# EAGLE design DAC_Test_PCB (EAGLE 9.0.0)
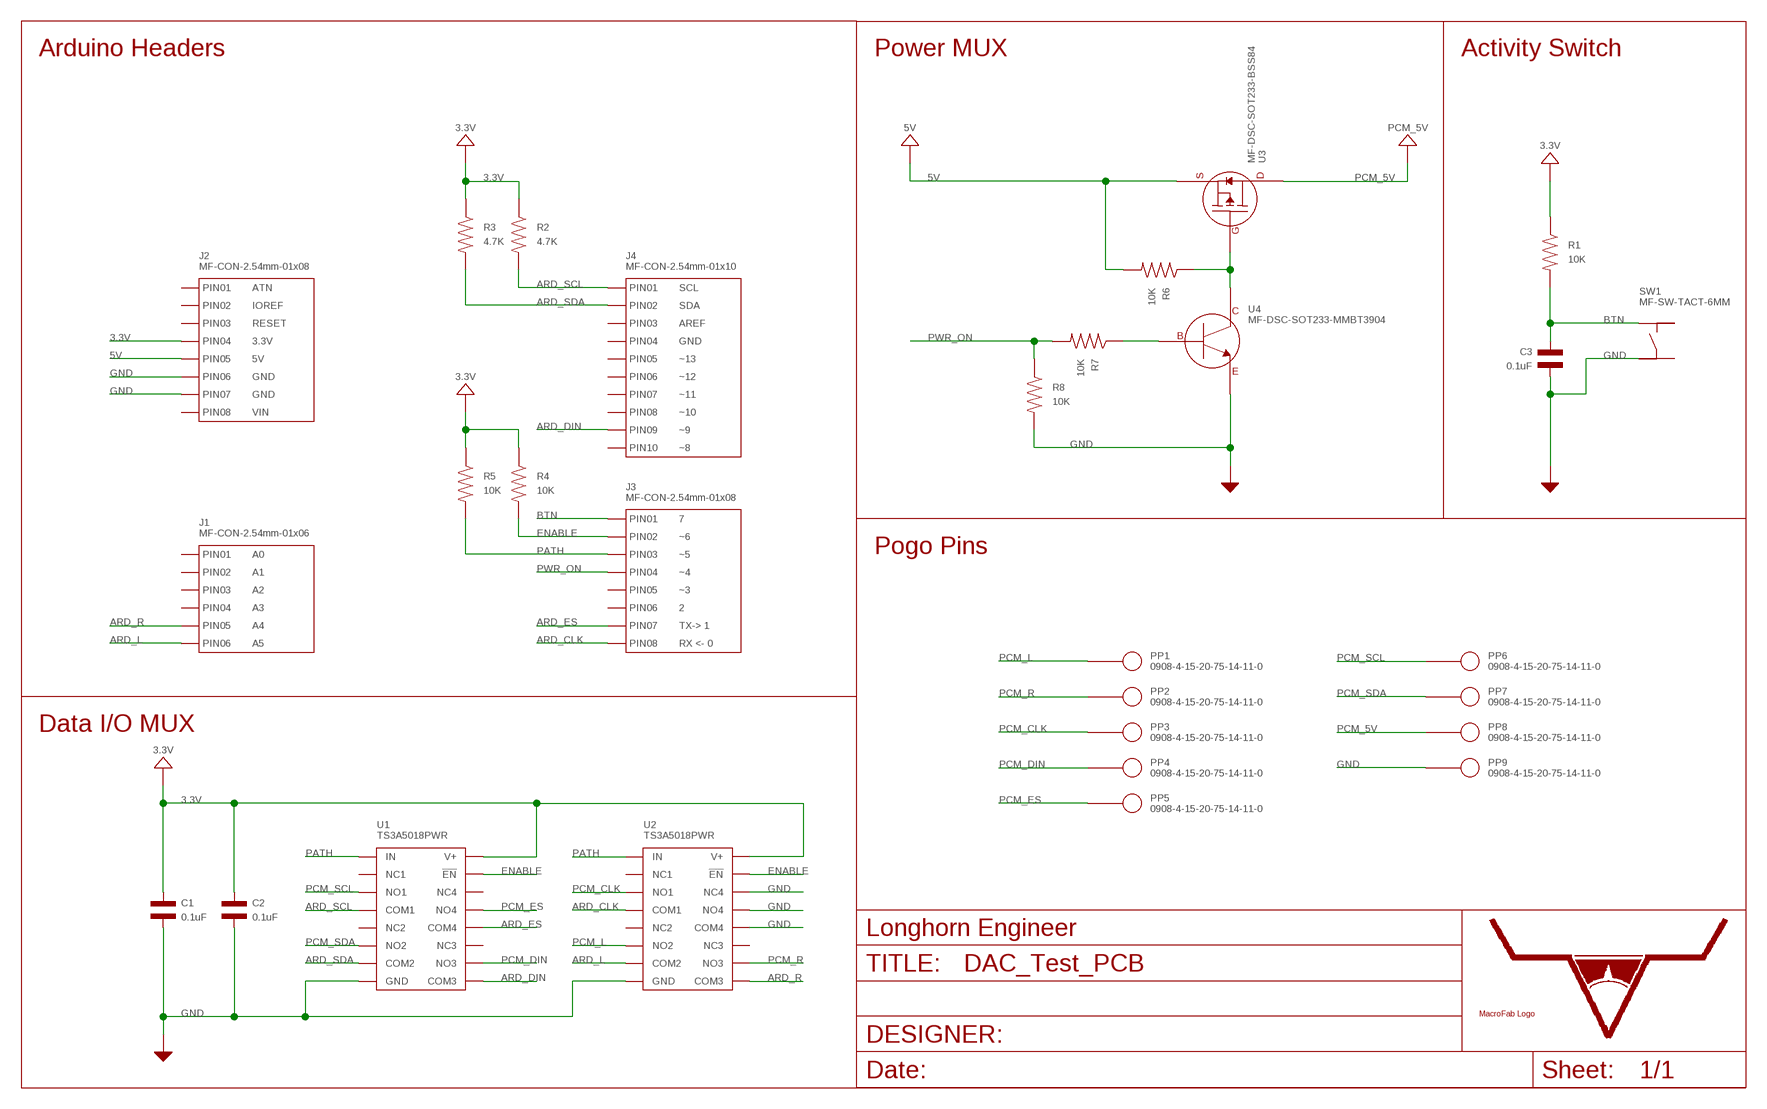
[diagram p0: schematic, sheet 1]

## Parts
C1  0.1uF  CAPACITOR_NP_0603  [C0603]
C2  0.1uF  CAPACITOR_NP_0603  [C0603]
C3  0.1uF  CAPACITOR_NP_0603  [C0603]
J1  MF-CON-2.54mm-01x06  CON_01X06_PTH_2.54MM  [PTH_2.54MM_01X06]
J2  MF-CON-2.54mm-01x08  CON_01X08_PTH_2.54MM  [PTH_2.54MM_01X08]
J3  MF-CON-2.54mm-01x08  CON_01X08_PTH_2.54MM  [PTH_2.54MM_01X08]
J4  MF-CON-2.54mm-01x10  CON_01X10_PTH_2.54MM  [PTH_2.54MM_01X10]
PP1  0908-4-15-20-75-14-11-0  POGO_PIN_0908-4-15-20-75-14-11-0  [0908-4-15-20-75-14-11-0]
PP2  0908-4-15-20-75-14-11-0  POGO_PIN_0908-4-15-20-75-14-11-0  [0908-4-15-20-75-14-11-0]
PP3  0908-4-15-20-75-14-11-0  POGO_PIN_0908-4-15-20-75-14-11-0  [0908-4-15-20-75-14-11-0]
PP4  0908-4-15-20-75-14-11-0  POGO_PIN_0908-4-15-20-75-14-11-0  [0908-4-15-20-75-14-11-0]
PP5  0908-4-15-20-75-14-11-0  POGO_PIN_0908-4-15-20-75-14-11-0  [0908-4-15-20-75-14-11-0]
PP6  0908-4-15-20-75-14-11-0  POGO_PIN_0908-4-15-20-75-14-11-0  [0908-4-15-20-75-14-11-0]
PP7  0908-4-15-20-75-14-11-0  POGO_PIN_0908-4-15-20-75-14-11-0  [0908-4-15-20-75-14-11-0]
PP8  0908-4-15-20-75-14-11-0  POGO_PIN_0908-4-15-20-75-14-11-0  [0908-4-15-20-75-14-11-0]
PP9  0908-4-15-20-75-14-11-0  POGO_PIN_0908-4-15-20-75-14-11-0  [0908-4-15-20-75-14-11-0]
R1  10K  RESISTOR_0603  [R0603]
R2  4.7K  RESISTOR_0603  [R0603]
R3  4.7K  RESISTOR_0603  [R0603]
R4  10K  RESISTOR_0603  [R0603]
R5  10K  RESISTOR_0603  [R0603]
R6  10K  RESISTOR_0603  [R0603]
R7  10K  RESISTOR_0603  [R0603]
R8  10K  RESISTOR_0603  [R0603]
SW1  MF-SW-TACT-6MM  TACT_6MM  [TACT6MM]
U1  TS3A5018PWR  [TS3A5018_TTSOP-16]
U2  TS3A5018PWR  [TS3A5018_TTSOP-16]
U3  MF-DSC-SOT233-BSS84  P-CHANNEL_FET_BSS84_SOT-23-3  [SOT-23-3]
U4  MF-DSC-SOT233-MMBT3904  NPN_BJTMMBT3904_SOT-23-3  [SOT-23-3]
U$8  LHE_FRAME  [LHE_FRAME]
U$9  MF_LOGOLOGO_MEDIUM  [MF_LOGO_MEDIUM]

## Nets
3.3V: C1.P$1 C2.P$1 J2.P$4(PIN4) R1.P$1 R2.P$1 R3.P$1 R4.P$1 R5.P$1 U1.16(V+) U2.16(V+)
5V: J2.P$5(PIN5) R6.P$2 U3.P$2(SOURCE)
ARD_CLK: J3.P$8(PIN8) U2.4(COM1)
ARD_DIN: J4.P$9(PIN9) U1.9(COM3)
ARD_ES: J3.P$7(PIN7) U1.12(COM4)
ARD_L: J1.P$6(PIN6) U2.7(COM2)
ARD_R: J1.P$5(PIN5) U2.9(COM3)
ARD_SCL: J4.P$1(PIN1) R2.P$2 U1.4(COM1)
ARD_SDA: J4.P$2(PIN2) R3.P$2 U1.7(COM2)
BASE: R7.P$1 U4.P$1(BASE)
BTN: C3.P$1 J3.P$1(PIN1) R1.P$2 SW1.P$1
COLLECTOR: R6.P$1 U3.P$1(GATE) U4.P$3(COLLECTOR)
ENABLE: J3.P$2(PIN2) R4.P$2 U1.15(EN') U2.15(EN')
GND: C1.P$2 C2.P$2 C3.P$2 J2.P$6(PIN6) J2.P$7(PIN7) PP9.P$1 R8.P$2 SW1.P$3 U1.8(GND) U2.8(GND) U2.12(COM4) U2.13(NO4) U2.14(NC4) U4.P$2(EMITTER)
PATH: J3.P$3(PIN3) R5.P$2 U1.1(IN) U2.1(IN)
PCM_5V: PP8.P$1 U3.P$3(DRAIN)
PCM_CLK: PP3.P$1 U2.3(NO1)
PCM_DIN: PP4.P$1 U1.10(NO3)
PCM_ES: PP5.P$1 U1.13(NO4)
PCM_L: PP1.P$1 U2.6(NO2)
PCM_R: PP2.P$1 U2.10(NO3)
PCM_SCL: PP6.P$1 U1.3(NO1)
PCM_SDA: PP7.P$1 U1.6(NO2)
PWR_ON: J3.P$4(PIN4) R7.P$2 R8.P$1
Unconnected: J1.P$1(PIN1) J1.P$2(PIN2) J1.P$3(PIN3) J1.P$4(PIN4) J2.P$1(PIN1) J2.P$2(PIN2) J2.P$3(PIN3) J2.P$8(PIN8) J3.P$5(PIN5) J3.P$6(PIN6) J4.P$3(PIN3) J4.P$4(PIN4) J4.P$5(PIN5) J4.P$6(PIN6) J4.P$7(PIN7) J4.P$8(PIN8) J4.P$10(PIN10) SW1.P$2 SW1.P$4 U1.2(NC1) U1.5(NC2) U1.11(NC3) U1.14(NC4) U2.2(NC1) U2.5(NC2) U2.11(NC3)

## Notes on the sheet
- Arduino Headers | Power MUX | Activity Switch
- Pogo Pins
- Data I/O MUX

## Library data of the parts
C1-C3 = MF_Passives:CAPACITOR_NP: Library: MF_Passives Description: Device for Non-Polarized Capacitors. Manufacture part number (MPN) can be added via Attributes. Check https://factory.macrofab.com/parts for the house parts list.; POPULATE: 1
J1 = MF_Connectors:CON_01X06: Library: MF_Connectors Description: Header Connector with 6 Positions and 01 Rows. Use the LABEL Attribute to label the pin on the schematic and PCB. You can remove the attributes on the PCB by using the SMASH function on the part and then deleting the text.; HOUSEPART: YES; LABEL01: A0; LABEL02: A1; LABEL03: A2; LABEL04: A3; LABEL05: A4; LABEL06: A5; MPN: MF-CON-2.54mm-01x06; POPULATE: 1; URL: https://factory.macrofab.com/part/MF-CON-2.54mm-01x06
J2 = MF_Connectors:CON_01X08: Library: MF_Connectors Description: Header Connector with 8 Positions and 01 Rows. Use the LABEL Attribute to label the pin on the schematic and PCB. You can remove the attributes on the PCB by using the SMASH function on the part and then deleting the text.; HOUSEPART: YES; LABEL01: ATN; LABEL02: IOREF; LABEL03: RESET; LABEL04: 3.3V; LABEL05: 5V; LABEL06: GND; LABEL07: GND; LABEL08: VIN; MPN: MF-CON-2.54mm-01x08; POPULATE: 1; URL: https://factory.macrofab.com/part/MF-CON-2.54mm-01x08
J3 = MF_Connectors:CON_01X08: Library: MF_Connectors Description: Header Connector with 8 Positions and 01 Rows. Use the LABEL Attribute to label the pin on the schematic and PCB. You can remove the attributes on the PCB by using the SMASH function on the part and then deleting the text.; HOUSEPART: YES; LABEL01: 7; LABEL02: ~6; LABEL03: ~5; LABEL04: ~4; LABEL05: ~3; LABEL06: 2; LABEL07: TX-> 1; LABEL08: RX <- 0; MPN: MF-CON-2.54mm-01x08; POPULATE: 1; URL: https://factory.macrofab.com/part/MF-CON-2.54mm-01x08
J4 = MF_Connectors:CON_01X10: Library: MF_Connectors Description: Header Connector with 10 Positions and 01 Rows. Use the LABEL Attribute to label the pin on the schematic and PCB. You can remove the attributes on the PCB by using the SMASH function on the part and then deleting the text.; HOUSEPART: YES; LABEL01: SCL; LABEL02: SDA; LABEL03: AREF; LABEL04: GND; LABEL05: ~13; LABEL06: ~12; LABEL07: ~11; LABEL08: ~10; LABEL09: ~9; LABEL10: ~8; MPN: MF-CON-2.54mm-01x10; POPULATE: 1; URL: https://factory.macrofab.com/part/MF-CON-2.54mm-01x10
PP1-PP9 = PP_Connectors:POGO_PIN; POPULATE: 1
R1-R8 = MF_Passives:RESISTOR: Library: MF_Passives Description: Device for Resistors. Manufacture part number (MPN), Voltage, Tolerance, and Wattage Rating can be added via Attributes. Check https://factory.macrofab.com/parts for the house parts list.; POPULATE: 1
SW1 = MF_Switches:TACT: Library: MF_Switches Description: Device for Tact Switches. Manufacture part number (MFG#) can be added via Attributes.; HOUSEPART: YES; MPN: MF-SW-TACT-6MM; POPULATE: 1; URL: https://factory.macrofab.com/part/MF-SW-TACT-6MM
U1 U2 = PP_AnalogIC:TS3A5018: Manufacturer Part #: TS3A5018 Manufacturer: Texas Instruments Description: Analog Switch ICs 10-Ohm Quad SPDT Analog Switch; POPULATE: 1
U3 = MF_Discrete_Semiconductor:P-CHANNEL_FET: Library: MF_Discrete_Semiconductor Description: Device for Single P-Channel Mosfet. Manufacture part number (MFG#) can be added via Attributes.; HOUSEPART: YES; MPN: MF-DSC-SOT233-BSS84; POPULATE: 1; URL: https://factory.macrofab.com/part/MF-DSC-SOT233-BSS84
U4 = MF_Discrete_Semiconductor:NPN_BJT: Library: MF_Discrete_Semiconductor Description: Device for Single NPN BJT Transistors. Manufacture part number (MFG#) can be added via Attributes.; HOUSEPART: YES; MPN: MF-DSC-SOT233-MMBT3904; POPULATE: 1; URL: https://factory.macrofab.com/part/MF-DSC-SOT233-MMBT3904
U$8 = PP_Aesthetics:LHE_FRAME; DNAME: Parker Dillmann; REVNUM: REV 1
U$9 = PP_Aesthetics:MF_LOGO; POPULATE: 0

## Board
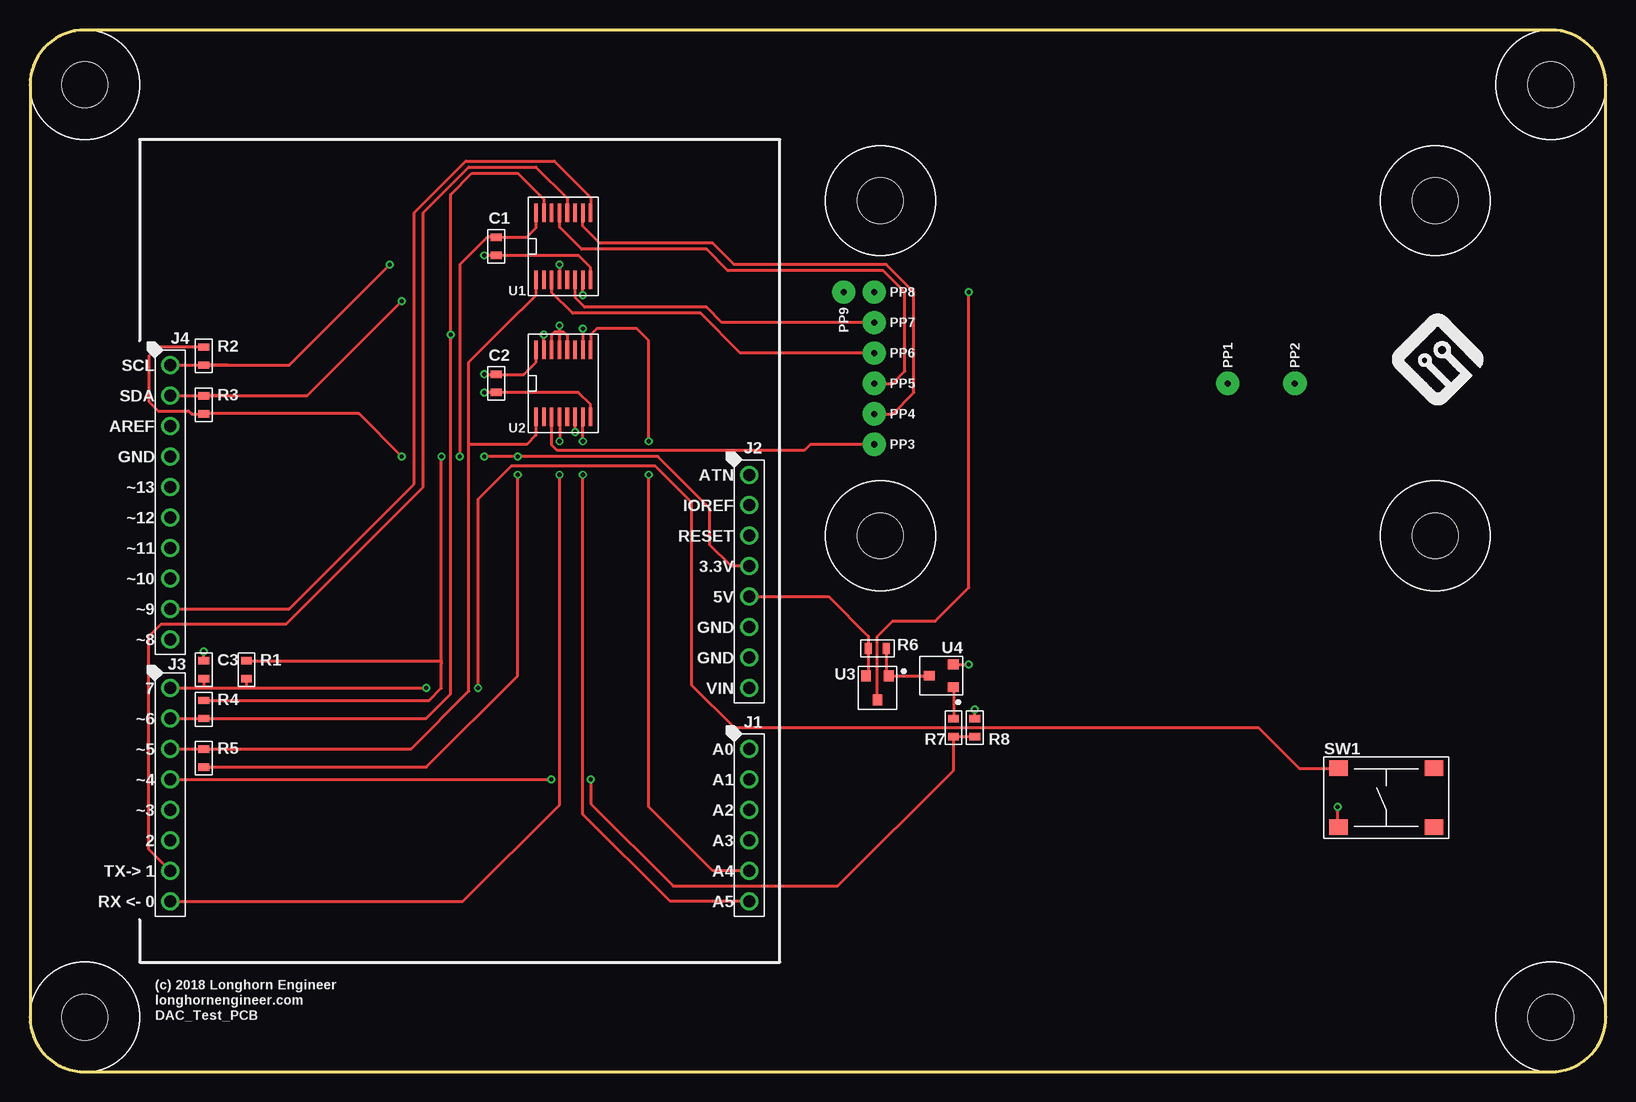
[diagram p1: board, top side]
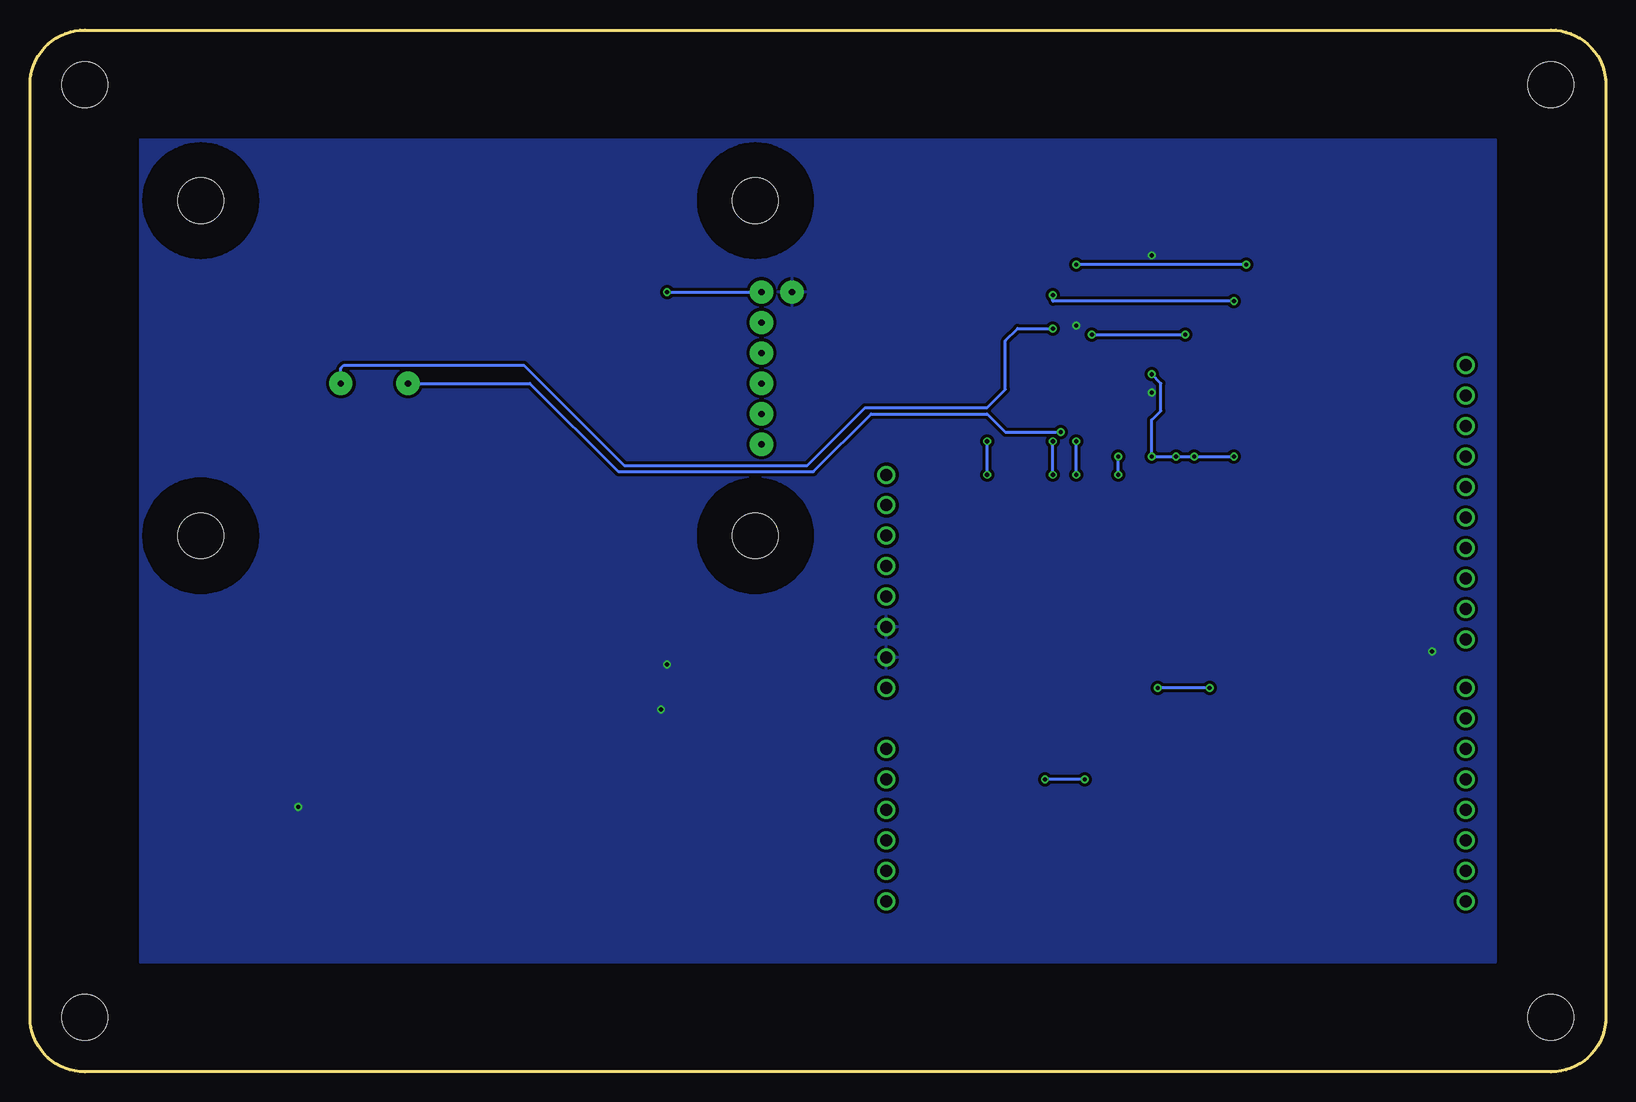
[diagram p2: board, bottom side, seen from below]

Size 131.32 x 86.87 mm. Coordinates in mm from the lower left corner, seen from the top.
Outline: 0,82.3 0,4.57 arc90 4.57,0 126.75,0 arc90 131.32,4.57 131.32,82.3 arc90 126.75,86.87 4.57,86.87 arc90 0,82.3
Copper layers (1*16): Top 0.035mm / dielectric 1.5mm / Bottom 0.035mm
Design rules "MF_Standard_2_Layer": minimum track width 5mil, minimum drill 12mil, track to track 5mil, track to pad 5mil, pad to pad 5mil, via to via 5mil, smd to smd 0mil, copper to edge 10mil, drill to drill 10mil, minimum pad ring 6mil, minimum via ring 6mil, stop-mask expansion 2mil, vias tented up to drill 25mil, thermal gap 10mil

### Footprints (pad centres in the part's own frame; a part is rotated, then mirrored left to right if it is on the bottom)
C0603 = smd 0.6 x 0.9: P$1 -0.75,0; P$2 0.75,0
PTH_2.54MM_01X06 = drill 1: P$1 -6.35,0; P$2 -3.81,0; P$3 -1.27,0; P$4 1.27,0; P$5 3.81,0; P$6 6.35,0
PTH_2.54MM_01X08 = drill 1: P$1 -8.89,0; P$2 -6.35,0; P$3 -3.81,0; P$4 -1.27,0; P$5 1.27,0; P$6 3.81,0; P$7 6.35,0; P$8 8.89,0
PTH_2.54MM_01X10 = drill 1: P$1 -11.43,0; P$2 -8.89,0; P$3 -6.35,0; P$4 -3.81,0; P$5 -1.27,0; P$6 1.27,0; P$7 3.81,0; P$8 6.35,0; P$9 8.89,0; P$10 11.43,0
0908-4-15-20-75-14-11-0 = drill 0.508 pad 1.93: P$1 0,0
R0603 = smd 0.6 x 0.9: P$1 -0.75,0; P$2 0.75,0
TACT6MM = smd 1.55 x 1.3: P$1 -3.975,2.45; P$2 3.975,2.45; P$3 -3.975,-2.45; P$4 3.975,-2.45
TS3A5018_TTSOP-16 = smd 1.55 x 0.3: 1 -2.8,2.275; 2 -2.8,1.625; 3 -2.8,0.975; 4 -2.8,0.325; 5 -2.8,-0.325; 6 -2.8,-0.975; 7 -2.8,-1.625; 8 -2.8,-2.275; 9 2.8,-2.275; 10 2.8,-1.625; 11 2.8,-0.975; 12 2.8,-0.325; 13 2.8,0.325; 14 2.8,0.975; 15 2.8,1.625; 16 2.8,2.275
SOT-23-3 = smd 0.9 x 0.8: P$1 -1,0.95; P$2 -1,-0.95; P$3 1,0
MOUNT_HOLE_150MIL = hole 3.81: 0,0

### Placement (x,y rotation side)
C1  38.86,68.83 270 top
C2  38.86,57.4 270 top
C3  14.48,33.53 90 top
J1  59.94,20.57 270 top
J2  59.94,40.89 270 top
J3  11.68,23.11 270 top
J4  11.68,47.5 270 top
PP1  99.82,57.4 90 top
PP2  105.41,57.4 90 top
PP3  70.36,52.32 0 top
PP4  70.36,54.86 0 top
PP5  70.36,57.4 0 top
PP6  70.36,59.94 0 top
PP7  70.36,62.48 0 top
PP8  70.36,65.02 0 top
PP9  67.82,65.02 270 top
R1  18.03,33.53 270 top
R2  14.48,59.69 270 top
R3  14.48,55.63 90 top
R4  14.48,30.23 270 top
R5  14.48,26.16 90 top
R6  70.61,35.31 180 top
R7  76.96,28.7 270 top
R8  78.74,28.7 90 top
SW1  113.03,22.86 0 top
U1  44.45,68.83 90 top
U2  44.45,57.4 90 top
U3  70.61,32 270 top
U4  75.95,33.02 180 top
U$4  [MOUNT_HOLE_150MIL]  70.87,72.64 0 top
U$5  [MOUNT_HOLE_150MIL]  70.87,44.7 0 top
U$6  [MOUNT_HOLE_150MIL]  117.09,44.7 0 top
U$7  [MOUNT_HOLE_150MIL]  117.09,72.64 0 top
U$8  10.41,1.78 0 top
U$9  113.54,55.63 0 top
U$16  [MOUNT_HOLE_150MIL]  4.57,82.3 0 top
U$17  [MOUNT_HOLE_150MIL]  4.57,4.57 0 top
U$18  [MOUNT_HOLE_150MIL]  126.75,4.57 0 top
U$19  [MOUNT_HOLE_150MIL]  126.75,82.3 0 top

### Tracks (layer width: path | path; a pad name or v marks a point on that pad's centre or on a via)
3.3V  (via drill 0.35)
  Top 0.254: U1.16 42.17,70.37 41.39,69.58 C1.P$1 38.09,69.58 35.81,67.31 v35.81,51.31 | U2.16 42.17,59.19 41.14,58.15 C2.P$1 v37.85,58.15 v37.85,58.17 | J2.P$4 58.42,42.16 56.64,43.94 56.64,46.99 52.32,51.31 v40.64,51.31 v37.85,51.31 | R2.P$1 10.66,60.44 9.91,59.69 9.91,55.88 10.67,55.12 13.21,55.12 13.46,54.86 R3.P$1 27.42,54.88 v30.99,51.31 | R4.P$1 33.26,30.98 34.29,32 34.29,34.04 34.29,34.28 | 34.29,34.28 v34.29,51.31 | R5.P$1 33.03,25.41 40.64,33.02 v40.64,49.78 | R1.P$1 34.29,34.28
  Bottom 0.254: v30.99,51.31 v34.29,51.31 v35.81,51.31 v37.85,51.31 37.85,54.36 37.08,55.12 37.08,57.4 v37.85,58.17 | v40.64,49.78 v40.64,51.31
5V
  Top 0.254: U3.P$2 arc90 69.86,33.2 R6.P$2 69.86,36.31 66.55,39.62 J2.P$5
ARD_CLK  (via drill 0.35)
  Top 0.254: J3.P$8 36.07,14.22 44.12,22.28 v44.12,49.78 | U2.4 v44.12,52.58
  Bottom 0.254: v44.12,49.78 v44.12,52.58
ARD_DIN
  Top 0.254: J4.P$9 21.59,38.61 32,49.02 32,71.63 36.32,75.95 43.69,75.95 46.73,72.91 U1.9
ARD_ES
  Top 0.254: J3.P$7 9.91,18.54 9.91,36.32 10.92,37.34 21.34,37.34 32.77,48.77 32.77,71.63 36.58,75.44 42.16,75.44 44.77,72.83 U1.12
ARD_L  (via drill 0.35)
  Top 0.254: J1.P$6 53.34,14.22 46.07,21.49 v46.07,49.78 | v46.07,52.58 U2.7
  Bottom 0.254: v46.07,49.78 v46.07,52.58
ARD_R  (via drill 0.35)
  Top 0.254: J1.P$5 56.9,16.76 51.56,22.1 v51.56,49.78 | v51.56,52.58 51.56,60.96 50.55,61.98 47.24,61.98 46.73,61.46 U2.9
  Bottom 0.254: v51.56,49.78 v51.56,52.58
ARD_SCL  (via drill 0.35)
  Top 0.254: J4.P$1 16.51,58.93 R2.P$2 21.6,58.94 v29.97,67.31 | v44.12,67.31 U1.4
  Bottom 0.254: v29.97,67.31 v44.12,67.31
ARD_SDA  (via drill 0.35)
  Top 0.254: J4.P$2 16.51,56.39 R3.P$2 23.1,56.38 v30.99,64.26 | v46.07,64.77 U1.7
  Bottom 0.254: v30.99,64.26 46.07,64.26 v46.07,64.77
BASE
  Top 0.254: U4.P$1 76.96,32.05 R7.P$1
BTN  (via drill 0.35)
  Top 0.254: J3.P$1 14.48,32 | 14.48,32 18.03,32 | 18.03,32 v33.02,32 | v37.34,32 37.34,47.75 40.13,50.55 52.07,50.55 55.12,47.5 55.12,32.26 58.67,28.7 102.36,28.7 105.75,25.31 SW1.P$1 | C3.P$1 14.48,32 | R1.P$2 18.03,32
  Bottom 0.254: v33.02,32 v37.34,32
COLLECTOR
  Top 0.254: U4.P$3 71.58,33.02 U3.P$1 arc-90 71.36,33.2 R6.P$1
ENABLE  (via drill 0.35)
  Top 0.254: J3.P$2 R4.P$2 33.03,29.48 35.05,31.5 v35.05,61.47 35.05,73.15 36.83,74.93 40.64,74.93 42.82,72.75 U1.15 | U2.15 v42.82,61.47
  Bottom 0.254: v42.82,61.47 v35.05,61.47
GND  (via drill 0.35)
  Top 0.254: R8.P$2 v78.74,30.23 | U4.P$2 v78.23,33.97 | v37.85,56.64 v37.85,56.65 C2.P$2 45.71,56.65 46.73,55.64 U2.8 | C1.P$2 38.86,68.07 | 38.86,68.07 v37.85,68.07 | U2.14 43.48,61.47 43.73,61.72 44.12,61.72 | 44.12,61.72 44.45,61.72 44.77,61.4 U2.12 | U2.13 44.12,61.72 | 44.12,61.72 v44.12,62.23 | U1.8 46.73,67.07 45.72,68.07 38.86,68.07 | SW1.P$3 108.97,20.41 v108.97,22.1 | C3.P$2 v14.48,35.05
  pour Bottom (isolate 0.254): 9.14,77.72 122.17,77.72 122.17,9.14 9.14,9.14
PATH
  Top 0.254: U2.1 42.16,53.09 41.4,52.32 36.58,52.32 | 36.58,52.32 36.58,59.18 39.62,62.23 42.17,64.78 U1.1 | J3.P$3 R5.P$2 | R5.P$2 | R5.P$2 31.75,26.92 36.58,31.75 36.58,52.32
PCM_5V  (via drill 0.35)
  Top 0.254: U3.P$3 70.61,36.32 71.88,37.59 75.44,37.59 78.23,40.39 v78.23,65.02
  Bottom 0.254: v78.23,65.02 PP8.P$1
PCM_CLK
  Top 0.254: PP3.P$1 65.02,52.32 64.52,51.82 43.94,51.82 43.48,52.28 U2.3
PCM_DIN
  Top 0.254: PP4.P$1 71.88,54.86 73.66,56.64 73.66,65.02 71.37,67.31 58.67,67.31 56.9,69.09 47.5,69.09 46.07,70.51 U1.10
PCM_ES
  Top 0.254: PP5.P$1 71.88,57.4 72.9,58.42 72.9,65.02 71.12,66.8 58.17,66.8 56.39,68.58 45.97,68.58 44.12,70.43 U1.13
PCM_L  (via drill 0.35)
  Top 0.254: v45.42,53.34 U2.6
  Bottom 0.254: PP1.P$1 89.66,57.4 82.3,50.04 66.04,50.04 61.21,54.86 51.56,54.86 50.04,53.34 v45.42,53.34
PCM_R  (via drill 0.35)
  Top 0.254: v46.07,61.98 U2.10
  Bottom 0.254: PP2.P$1 105.41,58.67 105.16,58.93 90.17,58.93 81.79,50.55 66.55,50.55 61.72,55.37 51.56,55.37 50.04,56.9 50.04,60.96 49.02,61.98 v46.07,61.98
PCM_SCL
  Top 0.254: PP6.P$1 59.18,59.94 55.88,63.25 45.21,63.25 43.48,64.98 U1.3
PCM_SDA
  Top 0.254: PP7.P$1 57.66,62.48 56.39,63.75 46.23,63.75 45.42,64.56 U1.6
PWR_ON  (via drill 0.35)
  Top 0.254: J3.P$4 v43.43,24.38 | v46.74,24.38 46.74,22.35 53.59,15.49 67.31,15.49 76.96,25.15 R7.P$2 R8.P$1
  Bottom 0.254: v43.43,24.38 v46.74,24.38